# Altium schematic sheet USB-C.SchDoc
size A4; SheetNumber: 4; SheetTotal: 7
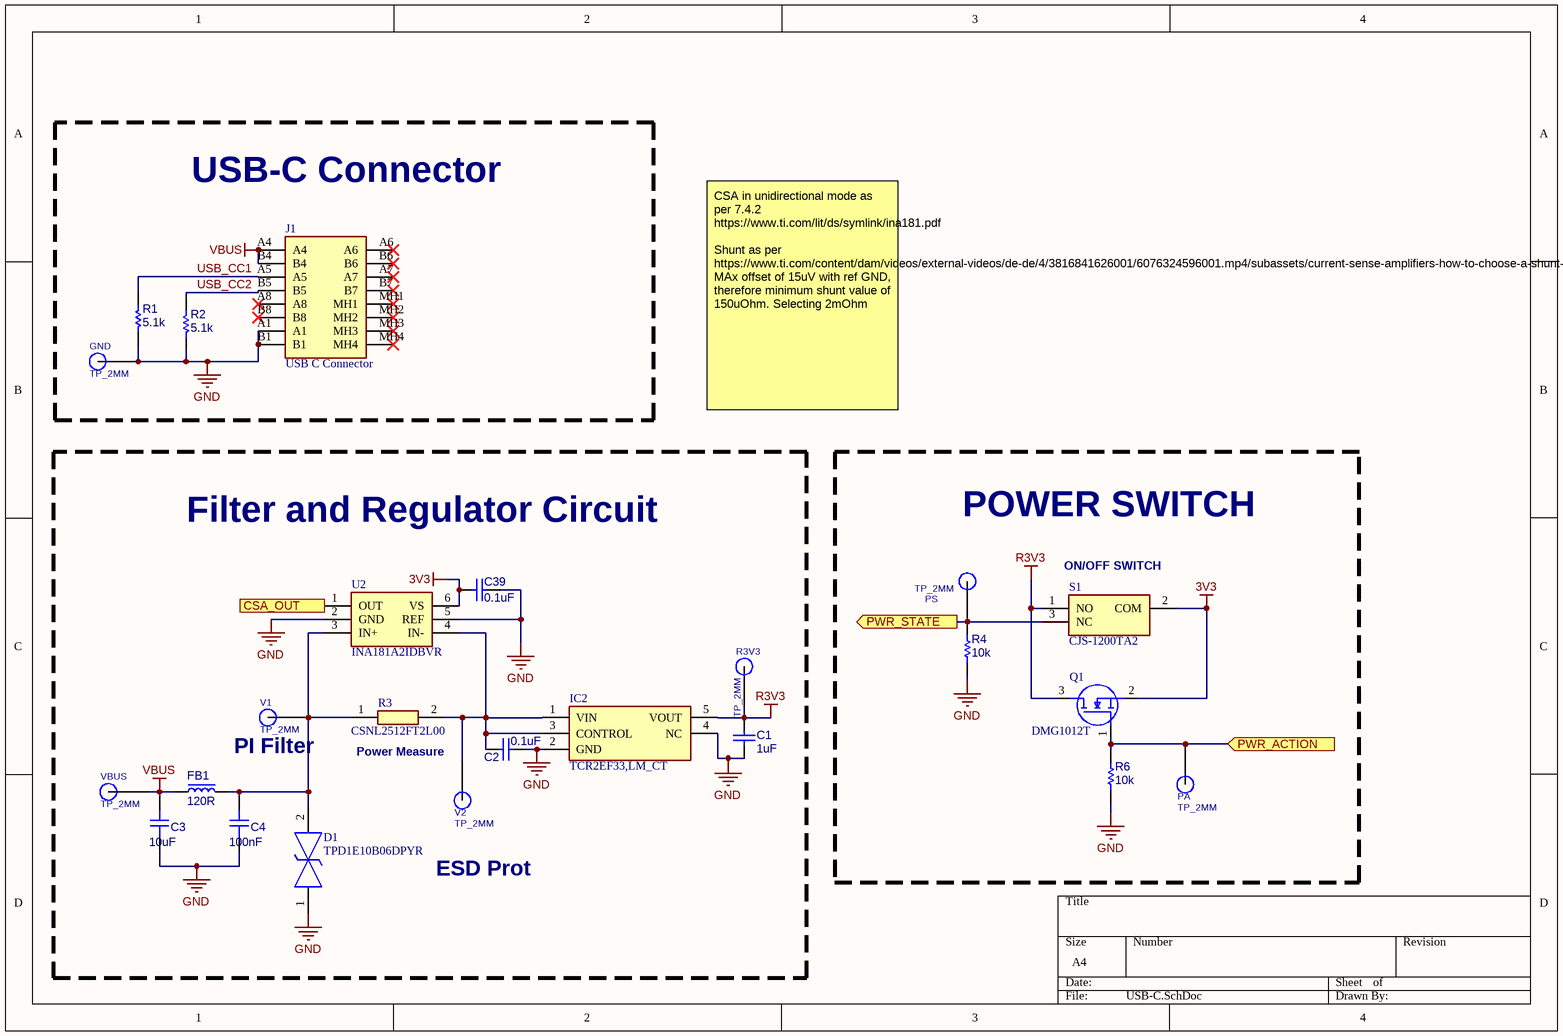
[diagram p0: USB-C.SchDoc]

## Parts
C1  value 1uF  [C0603]  (hidden comment: MCD-00237)
C2  value 0.1uF  [C0603]  (hidden comment: MCD-00237)
C3  CAP_0603_16V  [CAP_0603]  (value not drawn)
C4  CAP_0603_16V  [CAP_0603]  (value not drawn)
C39  value 0.1uF  [C0603]  (hidden comment: MCD-00237)
D1  TPD1E10B06DPYR  [TPD1E10B06DPYR]
FB1  120R  [FB_0603]
GND  TP_2MM  [TESTPOINT 2MM]
IC2  TCR2EF33,LM_CT  [SOT-25]
J1  USB C Connector  [UJ20CHGMSMT2P16TR]
PA  TP_2MM  [TESTPOINT 2MM]
PS  TP_2MM  [TESTPOINT 2MM]
Q1  DMG1012T  [SOT50P160X90-3N]
R1  value 5.1k  [RESC1608X55X25ML10T15-1]  (hidden comment: Resistor 10k +/-1% 0603 100mW)
R2  value 5.1k  [RESC1608X55X25ML10T15-1]  (hidden comment: Resistor 10k +/-1% 0603 100mW)
R3  CSNL2512FT2L00  [RESC6432X145N]
R3V3  TP_2MM  [TESTPOINT 2MM]
R4  value 10k  [RESC1608X55X25ML10T15-1]  (hidden comment: Resistor 10k +/-1% 0603 100mW)
R6  value 10k  [RESC1608X55X25ML10T15-1]  (hidden comment: Resistor 10k +/-1% 0603 100mW)
S1  CJS-1200TA2  [CJS1200TA2]
U2  INA181A2IDBVR  [SOT95P280X145-6N]
V1  TP_2MM  [TESTPOINT 2MM]
V2  TP_2MM  [TESTPOINT 2MM]
VBUS  TP_2MM  [TESTPOINT 2MM]

## Blocks framed on the sheet
USB-C Connector: GND J1 R1 R2
Filter and Regulator Circuit: C1-C4 C39 D1 FB1 IC2 R3 R3V3 U2 V1 V2 VBUS
POWER SWITCH: PA PS Q1 R4 R6 S1

## Ports
CSA_OUT (out), PWR_ACTION (in), PWR_STATE (out)

## Nets
3V3: C39.1 Q1.2(S) S1.2(COM) U2.6(VS)
GND: C1.2 C2.1 C3.1 C4.1 C39.2 D1.1 GND.TP(TP_2MM) IC2.2(GND) IC2.4(NC) J1.A1 J1.B1 R1.2 R2.2 R4.2 R6.2 U2.2(GND) U2.5(REF)
R3V3: C1.1 IC2.5(VOUT) Q1.3(D) R3V3.TP(TP_2MM) S1.1(NO)
VBUS: C3.2 FB1.2 J1.A4 J1.B4 VBUS.TP(TP_2MM)
CSA_OUT: U2.1(OUT) ; port CSA_OUT
PWR_ACTION: PA.TP(TP_2MM) Q1.1(G) R6.1 ; port PWR_ACTION
PWR_STATE: PS.TP(TP_2MM) R4.1 S1.3(NC) ; port PWR_STATE
USB_CC1: J1.A5 R1.1
USB_CC2: J1.B5 R2.1
NetC2_2: C2.2 IC2.1(VIN) IC2.3(CONTROL) R3.2 U2.4(IN-) V2.TP(TP_2MM)
NetC4_2: C4.2 D1.2 FB1.1 R3.1 U2.3(IN+) V1.TP(TP_2MM)

Not connected (* = marked no-connect by the designer): J1 A6* A7* A8* B6* B7* B8* MH1* MH2* MH3* MH4*

## Notes on the sheet
- CSA in unidirectional mode as per 7.4.2 https://www.ti.com/lit/ds/symlink/ina181.pdf
  Shunt as per
  https://www.ti.com/content/dam/videos/external-videos/de-de/4/3816841626001/6076324596001.mp4/subassets/current-sense-amplifiers-how-to-choose-a-shunt-resistor-presentation-quiz.pdf
  MAx offset of 15uV with ref GND, therefore minimum shunt value of 150uOhm. Selecting 2mOhm
- (near S1) ON/OFF SWITCH
- PI Filter
- (near R3) Power Measure
- (near C3) 10uF
- (near C4) 100nF
- ESD Prot

## Library data of the parts
C1 C2 C39 = CMP-112-000001-1: Capacitor, MLCC, 100nF, 6V3, X5R, 10%, 0603, T=0,8mm; Manufacturer Part Number: CC0603KRX5R5BB104; Manufacturer: YAGEO; ECCN_EU: NEC; Provided_By: SUBCO; ECCN_US: EAR99; Status: Released; ComponentLink1Description: Datasheet; Component Type: Capacitors; Pin Count: 2; Package: C0603; Source: MB1364.SCHLIB; Design Item ID: MCD-00237; Part_Type: Capacitor; Internal_Part_Number: MCD-00237; ComponentLink1URL: http://tunmcdsvn.tun.st.com/Component_Datasheet_Library/Trunk/Capacitors/Yageo_Multilayer_capacitor_X5R_series_100pF_to_100uF; Manufacturer_Part_Number: CC0603KRX5R5BB104
C3 C4 = CMP-004-000035-1: Capacitor SMD 0603 16V; Source: Schematic-Lib-PhilsLab.SchLib; Design Item ID: CAP_0603_16V
D1 = TPD1E10B06DPYR: TVS Diode (Bi-directional); Manufacturer_Name: Texas Instruments; Datasheet Link: https://www.ti.com/lit/ds/symlink/tpd1e10b06.pdf?HQS=TI-null-null-mousermode-df-pf-null-wwe&ts=1599077798252&ref_url=https%253A%252F%252Fwww.mouser.com%252F; Height: 0.45mm; Manufacturer_Part_Number: TPD1E10B06DPYR; Mouser Part Number: 595-TPD1E10B06DPYR; Mouser Price/Stock: https://www.mouser.co.uk/ProductDetail/Texas-Instruments/TPD1E10B06DPYR?qs=UFc95S4Z4CaJYpQ4xqTc0g%3D%3D; Arrow Part Number: TPD1E10B06DPYR; Arrow Price/Stock: https://www.arrow.com/en/products/tpd1e10b06dpyr/texas-instruments?region=nac
FB1 = CMP-010-000008-1: Ferrite Bead SMD 0603; Source: Schematic-Lib-PhilsLab.SchLib; Design Item ID: FB_0603
IC2 = TCR2EF33,LM_CT: Integrated Circuit; Manufacturer_Name: Toshiba; Manufacturer_Part_Number: TCR2EF33,LM(CT; Datasheet Link: https://toshiba.semicon-storage.com/eu/product/linear/power-supply/detail.TCR2EF33.html; Mouser Part Number: 757-TCR2EF33LMCT; Mouser Price/Stock: https://www.mouser.co.uk/ProductDetail/Toshiba/TCR2EF33LMCT?qs=EPmvyOv1YlPmhsvS3PaWfg%3D%3D; Arrow Part Number: TCR2EF33,LM(CT; Arrow Price/Stock: https://www.arrow.com/en/products/tcr2ef33lm-ct/toshiba?region=nac
J1 = CMP-026-000123-2: UJ20-C-H-G-MSMT-2-P16-TR Connector; Manufacturer_Name: Same Sky; Height: 3.36mm; Source: SamacSys.SchLib; Design Item ID: UJ20-C-H-G-MSMT-2-P16-TR; Datasheet Link: https://cz.mouser.com/ProductDetail/Same-Sky/UJ20-C-H-G-MSMT-2-P16-TR?qs=IKkN%2F947nfBldcIwp9d6BA%3D%3D; Mouser Part Number: 179-UJ20CHGMSMT2P16T; Manufacturer_Part_Number: UJ20-C-H-G-MSMT-2-P16-TR; Mouser Price/Stock: https://www.mouser.co.uk/ProductDetail/Same-Sky/UJ20-C-H-G-MSMT-2-P16-TR?qs=IKkN%2F947nfBldcIwp9d6BA%3D%3D; Author: Raphael Ho
Q1 = DMG1012T: MOSFET (N-Channel); Manufacturer_Name: Diodes Incorporated; Datasheet Link: https://www.diodes.com/datasheet/download/DMG1012T.pdf; Height: 0.9mm; Manufacturer_Part_Number: DMG1012T; Mouser Part Number: N/A; Mouser Price/Stock: https://www.mouser.co.uk/ProductDetail/Diodes-Incorporated/DMG1012T?qs=Wj%2FVkw3K%252BMD5naxckZUW%2FA%3D%3D
R1 R2 R4 R6 = CMP-009-00181-1: Chip Resistor, 10k Ohm, 0.1 W, -55 to 155 degC, 0603 (1608 Metric); Voltage Rating: 50V; Tolerance: 1%; Source: Components - 14.11.22 - 11.28.SchLib; Design Item ID: CMP-009-00006-5; Created by: Micah Randall; Power: 100mW; Max Operating Temperature: 155°C; RoHS Compliant: Yes; Mounting Technology: SM; Case/Package: 0603; Min Operating Temperature: -55°C; Pins: 2
R3 = CSNL2512FT2L00: Resistor; Manufacturer_Name: Stackpole Electronics; Datasheet Link: https://cs.seielect.com/catalog/SEI-CSNL.pdf; Height: 1.45mm; Manufacturer_Part_Number: CSNL2512FT2L00; Arrow Part Number: CSNL2512FT2L00; Arrow Price/Stock: https://www.arrow.com/en/products/csnl2512ft2l00/stackpole-electronics?region=nac
S1 = CJS-1200TA2: Switch; Manufacturer_Name: Nidec Copal; Datasheet Link: http://www.nidec-copal-electronics.com/j/catalog/switch/cjs.pdf; Height: 2.5mm; Manufacturer_Part_Number: CJS-1200TA2; Mouser Part Number: 229-CJS-1200TA2; Mouser Price/Stock: https://www.mouser.co.uk/ProductDetail/Nidec-Components/CJS-1200TA2?qs=XeJtXLiO41Rf26ws0igWdA%3D%3D
U2 = INA181A2IDBVR: Undefined or Miscellaneous; Manufacturer_Name: Texas Instruments; Datasheet Link: http://www.ti.com/general/docs/suppproductinfo.tsp?distId=26&gotoUrl=http%3A%2F%2Fwww.ti.com%2Flit%2Fgpn%2Fina181; Height: 1.45mm; Manufacturer_Part_Number: INA181A2IDBVR; Mouser Part Number: 595-INA181A2IDBVR; Mouser Price/Stock: https://www.mouser.co.uk/ProductDetail/Texas-Instruments/INA181A2IDBVR?qs=5aG0NVq1C4wvxWxbAGEmKw%3D%3D; Arrow Part Number: INA181A2IDBVR; Arrow Price/Stock: https://www.arrow.com/en/products/ina181a2idbvr/texas-instruments?utm_currency=USD&region=nac